# EAGLE design interloper-v1 (EAGLE 7.7.0)
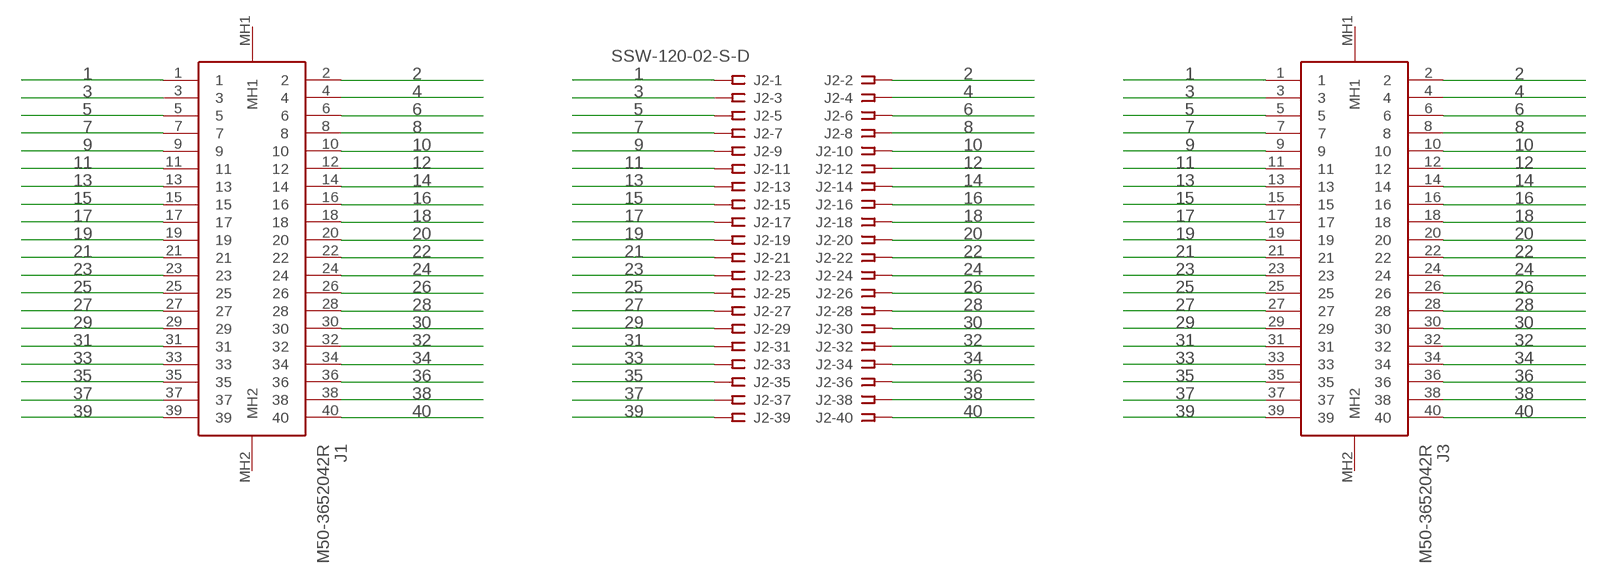
[diagram p0: schematic, sheet 1]

## Parts
J1  M50-3652042R  [M503652042R]
J2  SSW-120-02-S-D  [SSW-120-02-S-D]
J3  M50-3652042R  [M503652042R]

## Nets
1: J1.1 J2.1 J3.1
2: J1.2 J2.2 J3.2
3: J1.3 J2.3 J3.3
4: J1.4 J2.4 J3.4
5: J1.5 J2.5 J3.5
6: J1.6 J2.6 J3.6
7: J1.7 J2.7 J3.7
8: J1.8 J2.8 J3.8
9: J1.9 J2.9 J3.9
10: J1.10 J2.10 J3.10
11: J1.11 J2.11 J3.11
12: J1.12 J2.12 J3.12
13: J1.13 J2.13 J3.13
14: J1.14 J2.14 J3.14
15: J1.15 J2.15 J3.15
16: J1.16 J2.16 J3.16
17: J1.17 J2.17 J3.17
18: J1.18 J2.18 J3.18
19: J1.19 J2.19 J3.19
20: J1.20 J2.20 J3.20
21: J1.21 J2.21 J3.21
22: J1.22 J2.22 J3.22
23: J1.23 J2.23 J3.23
24: J1.24 J2.24 J3.24
25: J1.25 J2.25 J3.25
26: J1.26 J2.26 J3.26
27: J1.27 J2.27 J3.27
28: J1.28 J2.28 J3.28
29: J1.29 J2.29 J3.29
30: J1.30 J2.30 J3.30
31: J1.31 J2.31 J3.31
32: J1.32 J2.32 J3.32
33: J1.33 J2.33 J3.33
34: J1.34 J2.34 J3.34
35: J1.35 J2.35 J3.35
36: J1.36 J2.36 J3.36
37: J1.37 J2.37 J3.37
38: J1.38 J2.38 J3.38
39: J1.39 J2.39 J3.39
40: J1.40 J2.40 J3.40
Unconnected: J1.MH1 J1.MH2 J3.MH1 J3.MH2

## Library data of the parts
J1 J3 = M50-3652042R:M50-3652042R: HARWIN Archer M50, 1.27mm Pitch, 40 Way, 2 Row, Vertical PCB Header, Surface Mount Source: Datasheet <https://componentsearchengine.com/Datasheets/1/M50-3652042R.pdf>; ARROW_PART_NUMBER: M50-3652042R; DESCRIPTION: HARWIN Archer M50, 1.27mm Pitch, 40 Way, 2 Row, Vertical PCB Header, Surface Mount; HEIGHT: 11.6mm; MANUFACTURER_NAME: Harwin; MANUFACTURER_PART_NUMBER: M50-3652042R; MOUSER_PART_NUMBER: 855-M50-3652042R; MOUSER_PRICE-STOCK: https://www.mouser.co.uk/ProductDetail/Harwin/M50-3652042R?qs=gf2s0yP%252B7bfJki3ikJTXrQ%3D%3D
J2 = con-samtec:SSW-120-02-S-D: THROUGH-HOLE .025" SQ POST SOCKET Source: Samtec SSW.pdf; MPN: SSW-120-02-S-D; OC_FARNELL: unknown; OC_NEWARK: 11P9639

## Board
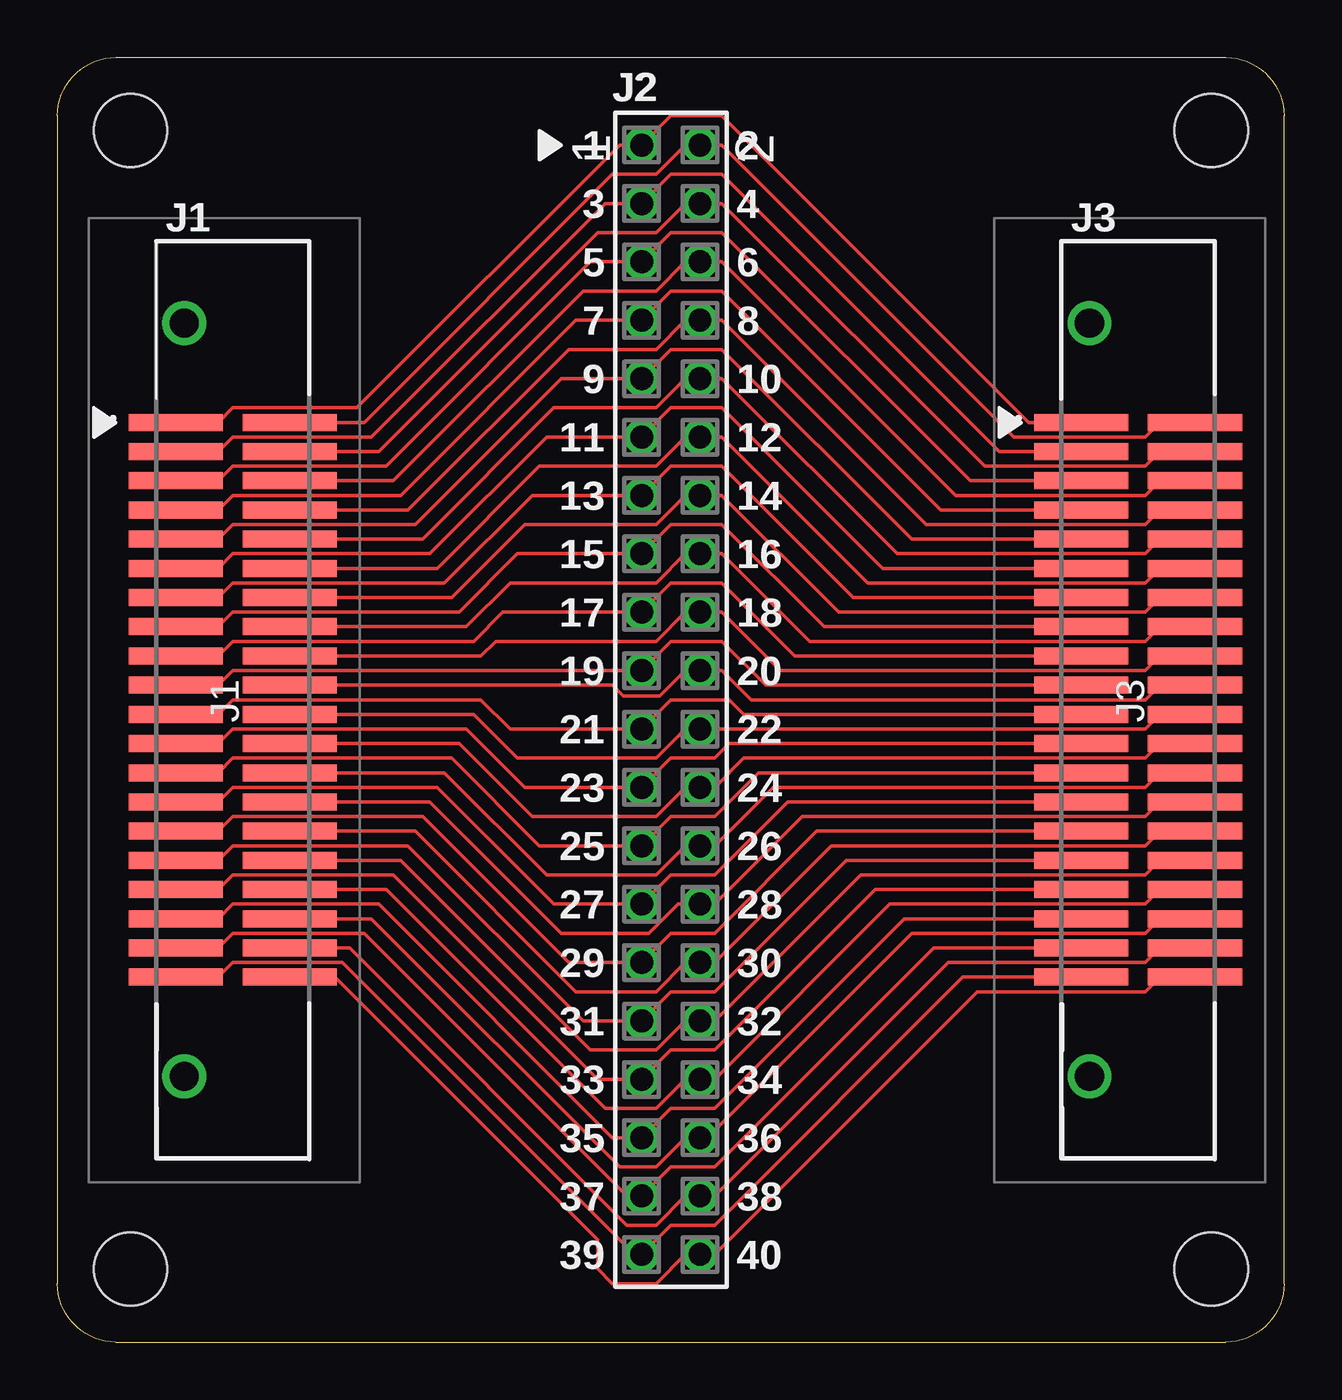
[diagram p1: board, top side]
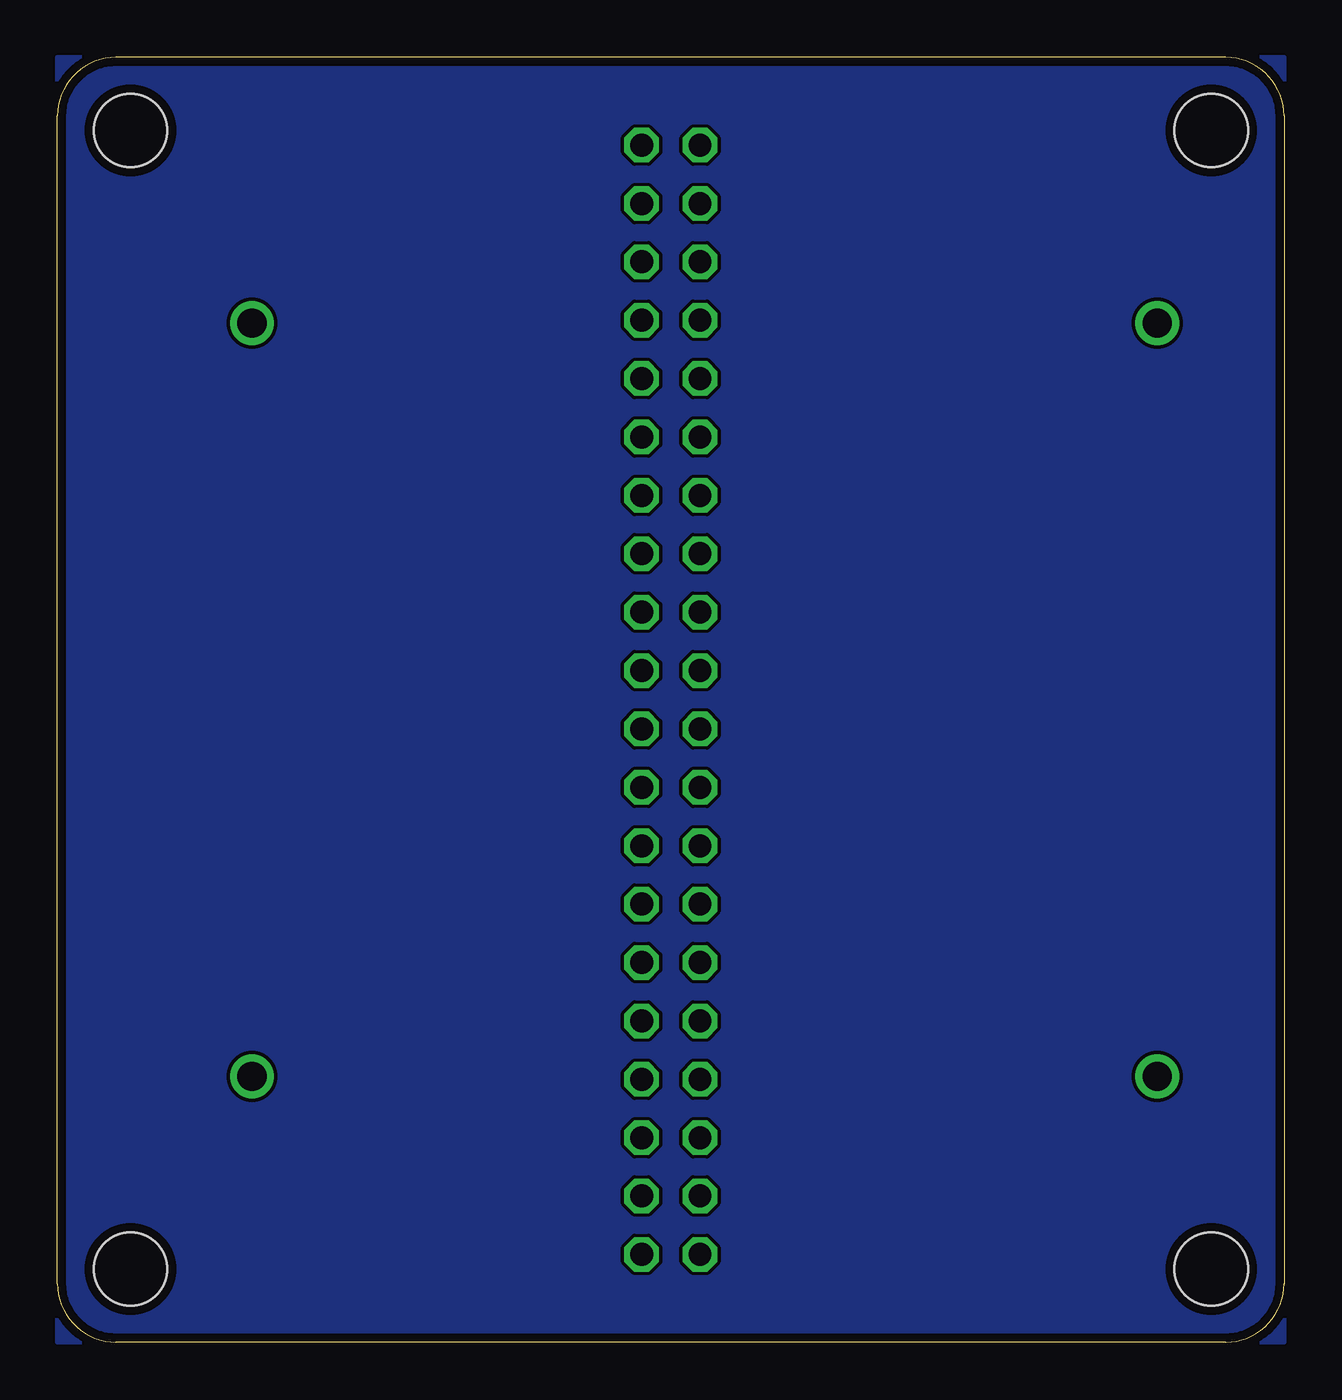
[diagram p2: board, bottom side, seen from below]

Size 53.34 x 55.88 mm. Coordinates in mm from the lower left corner, seen from the top.
Outline: 0,53.34 arc-90 2.54,55.88 50.8,55.88 arc-90 53.34,53.34 53.34,2.54 arc-90 50.8,0 2.54,0 arc-90 0,2.54 0,53.34
Copper layers (1*16): Top 0.035559375mm / dielectric 1.6mm / Bottom 0.035559375mm
Design rules "oshpark-2layer-2018": minimum track width 6mil, minimum drill 10mil, track to track 6mil, track to pad 6mil, pad to pad 6mil, via to via 6mil, smd to smd 6mil, copper to edge 15mil, drill to drill 6mil, minimum pad ring 5mil, minimum via ring 5mil, stop-mask expansion 2.5mil, vias tented up to drill 0mil, thermal gap 10mil
Holes 3.2 mm at 3.17,52.7 3.17,3.17 50.16,3.17 50.16,52.7

### Footprints (pad centres in the part's own frame; a part is rotated, then mirrored left to right if it is on the bottom)
M503652042R = smd 0.74 x 4.09: 1 -12.065,-2.475; 2 -12.065,2.475; 3 -10.795,-2.475; 4 -10.795,2.475; 5 -9.525,-2.475; 6 -9.525,2.475; 7 -8.255,-2.475; 8 -8.255,2.475; 9 -6.985,-2.475; 10 -6.985,2.475; 11 -5.715,-2.475; 12 -5.715,2.475; 13 -4.445,-2.475; 14 -4.445,2.475; 15 -3.175,-2.475; 16 -3.175,2.475; 17 -1.905,-2.475; 18 -1.905,2.475; 19 -0.635,-2.475; 20 -0.635,2.475; 21 0.635,-2.475; 22 0.635,2.475; 23 1.905,-2.475; 24 1.905,2.475; 25 3.175,-2.475; 26 3.175,2.475; 27 4.445,-2.475; 28 4.445,2.475; 29 5.715,-2.475; 30 5.715,2.475; 31 6.985,-2.475; 32 6.985,2.475; 33 8.255,-2.475; 34 8.255,2.475; 35 9.525,-2.475; 36 9.525,2.475; 37 10.795,-2.475; 38 10.795,2.475; 39 12.065,-2.475; 40 12.065,2.475 | drill 1.27 pad 1.905: MH1 -16.385,-2.11; MH2 16.385,-2.11
SSW-120-02-S-D = drill 1 pad 1.5 octagon: 1 -24.13,-1.27; 2 -24.13,1.27; 3 -21.59,-1.27; 4 -21.59,1.27; 5 -19.05,-1.27; 6 -19.05,1.27; 7 -16.51,-1.27; 8 -16.51,1.27; 9 -13.97,-1.27; 10 -13.97,1.27; 11 -11.43,-1.27; 12 -11.43,1.27; 13 -8.89,-1.27; 14 -8.89,1.27; 15 -6.35,-1.27; 16 -6.35,1.27; 17 -3.81,-1.27; 18 -3.81,1.27; 19 -1.27,-1.27; 20 -1.27,1.27; 21 1.27,-1.27; 22 1.27,1.27; 23 3.81,-1.27; 24 3.81,1.27; 25 6.35,-1.27; 26 6.35,1.27; 27 8.89,-1.27; 28 8.89,1.27; 29 11.43,-1.27; 30 11.43,1.27; 31 13.97,-1.27; 32 13.97,1.27; 33 16.51,-1.27; 34 16.51,1.27; 35 19.05,-1.27; 36 19.05,1.27; 37 21.59,-1.27; 38 21.59,1.27; 39 24.13,-1.27; 40 24.13,1.27

### Placement (x,y rotation side)
J1  7.62,27.94 270 top
J2  26.67,27.94 270 top
J3  46.99,27.94 270 top

### Tracks (layer width: path | path; a pad name or v marks a point on that pad's centre or on a via)
1
  Top 0.152: J1.1 6.99,40.01 7.62,40.64 13.02,40.64 24.45,52.07 J2.1 26.67,53.34 28.89,53.34 42.23,40.01 J3.1
2
  Top 0.152: J1.2 13.34,40.01 24.13,50.8 26.04,50.8 27.3,52.07 J2.2 28.89,52.07 41.59,39.37 47.31,39.37 47.94,40.01 J3.2
3
  Top 0.152: J1.3 6.99,38.73 7.62,39.37 13.65,39.37 23.81,49.53 J2.3 26.67,50.8 28.89,50.8 40.96,38.73 J3.3
4
  Top 0.152: J1.4 13.97,38.73 23.5,48.26 26.04,48.26 27.3,49.53 J2.4 28.89,49.53 40.32,38.1 47.31,38.1 47.94,38.73 J3.4
5
  Top 0.152: J1.5 6.99,37.47 7.62,38.1 14.29,38.1 23.18,46.99 J2.5 26.67,48.26 28.89,48.26 39.69,37.47 J3.5
6
  Top 0.152: J1.6 14.61,37.47 22.86,45.72 26.04,45.72 27.3,46.99 J2.6 28.89,46.99 39.05,36.83 47.31,36.83 47.94,37.47 J3.6
7
  Top 0.152: J1.7 6.99,36.2 7.62,36.83 14.92,36.83 22.54,44.45 J2.7 26.67,45.72 28.89,45.72 38.42,36.2 J3.7
8
  Top 0.152: J1.8 15.24,36.2 22.23,43.18 26.04,43.18 27.3,44.45 J2.8 28.89,44.45 37.78,35.56 47.31,35.56 47.94,36.2 J3.8
9
  Top 0.152: J1.9 6.99,34.92 7.62,35.56 15.56,35.56 21.91,41.91 J2.9 26.67,43.18 28.89,43.18 37.15,34.92 J3.9
10
  Top 0.152: J1.10 15.88,34.92 21.59,40.64 26.04,40.64 27.3,41.91 J2.10 28.89,41.91 36.51,34.29 47.31,34.29 47.94,34.92 J3.10
11
  Top 0.152: J1.11 6.99,33.66 7.62,34.29 16.19,34.29 21.27,39.37 J2.11 26.67,40.64 28.89,40.64 35.88,33.66 J3.11
12
  Top 0.152: J1.12 16.51,33.66 20.95,38.1 26.04,38.1 27.3,39.37 J2.12 28.89,39.37 35.24,33.02 47.31,33.02 47.94,33.66 J3.12
13
  Top 0.152: J1.13 6.99,32.38 7.62,33.02 16.83,33.02 20.64,36.83 J2.13 26.67,38.1 28.89,38.1 34.61,32.38 J3.13
14
  Top 0.152: J1.14 17.14,32.38 20.32,35.56 26.04,35.56 27.3,36.83 J2.14 28.89,36.83 33.97,31.75 47.31,31.75 47.94,32.38 J3.14
15
  Top 0.152: J1.15 6.99,31.11 7.62,31.75 17.46,31.75 20,34.29 J2.15 26.67,35.56 28.89,35.56 33.34,31.11 J3.15
16
  Top 0.152: J3.16 47.94,31.11 47.31,30.48 32.7,30.48 28.89,34.29 J2.16 27.3,34.29 26.04,33.02 19.68,33.02 17.78,31.11 J1.16
17
  Top 0.152: J3.17 32.07,29.84 28.89,33.02 26.67,33.02 J2.17 19.37,31.75 18.1,30.48 7.62,30.48 6.99,29.84 J1.17
18
  Top 0.152: J1.18 18.41,29.84 19.05,30.48 26.04,30.48 27.3,31.75 J2.18 28.89,31.75 31.43,29.21 47.31,29.21 47.94,29.84 J3.18
19
  Top 0.152: J1.19 6.99,28.57 7.62,29.21 J2.19 26.67,30.48 28.89,30.48 30.8,28.57 J3.19
20
  Top 0.152: J1.20 24.13,28.57 24.61,28.1 26.19,28.1 27.3,29.21 J2.20 28.89,29.21 30.16,27.94 47.31,27.94 47.94,28.57 J3.20
21
  Top 0.152: J1.21 6.99,27.3 7.62,27.94 18.41,27.94 19.68,26.67 J2.21 26.67,27.94 29.21,27.94 29.84,27.3 J3.21
22
  Top 0.152: J1.22 18.1,27.3 20,25.4 26.04,25.4 27.3,26.67 J2.22 47.31,26.67 47.94,27.3 J3.22
23
  Top 0.152: J1.23 6.99,26.04 7.62,26.67 17.78,26.67 20.32,24.13 J2.23 26.67,25.4 28.57,25.4 29.21,26.04 J3.23
24
  Top 0.152: J1.24 17.46,26.04 20.64,22.86 26.04,22.86 27.3,24.13 J2.24 28.57,24.13 29.84,25.4 47.31,25.4 47.94,26.04 J3.24
25
  Top 0.152: J1.25 6.99,24.77 7.62,25.4 17.14,25.4 20.95,21.59 J2.25 26.67,22.86 28.57,22.86 30.48,24.77 J3.25
26
  Top 0.152: J1.26 16.83,24.77 21.27,20.32 26.04,20.32 27.3,21.59 J2.26 28.57,21.59 31.11,24.13 47.31,24.13 47.94,24.77 J3.26
27
  Top 0.152: J1.27 6.99,23.5 7.62,24.13 16.51,24.13 21.59,19.05 J2.27 26.67,20.32 28.57,20.32 31.75,23.5 J3.27
28
  Top 0.152: J1.28 16.19,23.5 21.91,17.78 25.72,17.78 26.99,19.05 J2.28 28.57,19.05 32.38,22.86 47.31,22.86 47.94,23.5 J3.28
29
  Top 0.152: J1.29 6.99,22.23 7.62,22.86 15.88,22.86 22.23,16.51 J2.29 26.67,17.78 28.57,17.78 33.02,22.23 J3.29
30
  Top 0.152: J1.30 15.56,22.23 22.54,15.24 26.04,15.24 27.3,16.51 J2.30 28.57,16.51 33.66,21.59 47.31,21.59 47.94,22.23 J3.30
31
  Top 0.152: J1.31 6.99,20.95 7.62,21.59 15.24,21.59 22.86,13.97 J2.31 26.67,15.24 28.57,15.24 34.29,20.95 J3.31
32
  Top 0.152: J1.32 14.92,20.95 23.18,12.7 26.04,12.7 27.3,13.97 J2.32 28.57,13.97 34.92,20.32 47.31,20.32 47.94,20.95 J3.32
33
  Top 0.152: J1.33 6.99,19.68 7.62,20.32 14.61,20.32 23.5,11.43 J2.33 26.67,12.7 28.57,12.7 35.56,19.68 J3.33
34
  Top 0.152: J1.34 14.29,19.68 23.81,10.16 26.04,10.16 27.3,11.43 J2.34 28.57,11.43 36.2,19.05 47.31,19.05 47.94,19.68 J3.34
35
  Top 0.152: J1.35 6.99,18.41 7.62,19.05 13.97,19.05 24.13,8.89 J2.35 26.67,10.16 28.57,10.16 36.83,18.41 J3.35
36
  Top 0.152: J1.36 13.65,18.41 24.45,7.62 26.04,7.62 27.3,8.89 J2.36 28.26,8.89 37.15,17.78 47.31,17.78 47.94,18.41 J3.36
37
  Top 0.152: J1.37 6.99,17.14 7.62,17.78 13.34,17.78 24.77,6.35 J2.37 26.67,7.62 28.57,7.62 38.1,17.14 J3.37
38
  Top 0.152: J1.38 12.7,17.14 24.77,5.08 26.04,5.08 27.3,6.35 J2.38 28.57,6.35 38.73,16.51 47.31,16.51 47.94,17.14 J3.38
39
  Top 0.152: J1.39 6.99,15.88 7.62,16.51 12.38,16.51 25.08,3.81 J2.39 26.67,5.08 28.57,5.08 39.37,15.88 J3.39
40
  Top 0.152: J1.40 12.06,15.88 23.5,4.45 23.5,3.17 24.13,2.54 26.04,2.54 27.3,3.81 J2.40 28.57,3.81 40.01,15.24 47.31,15.24 47.94,15.88 J3.40 50.16,15.88
GND
  pour Bottom: 0,55.88 0,0 53.34,0 53.34,55.88

### Text on the board
_tsilk: J2 | 1 | 2 | 3 | 4 | J1 | J3 | 5 | 6 | 7 | 8 | 9 | 10 | 11 | 12 | 13 | 14 | 15 | 16 | 17 | 18 | 19 | 20 | 21 | 22 | 23 | 24 | 25 | 26 | 27 | 28 | 29 | 30 | 31 | 32 | 33 | 34 | 35 | 36 | 37 | 38 | 39 | 40